# EAGLE design MaxOr (EAGLE 7.1.0)
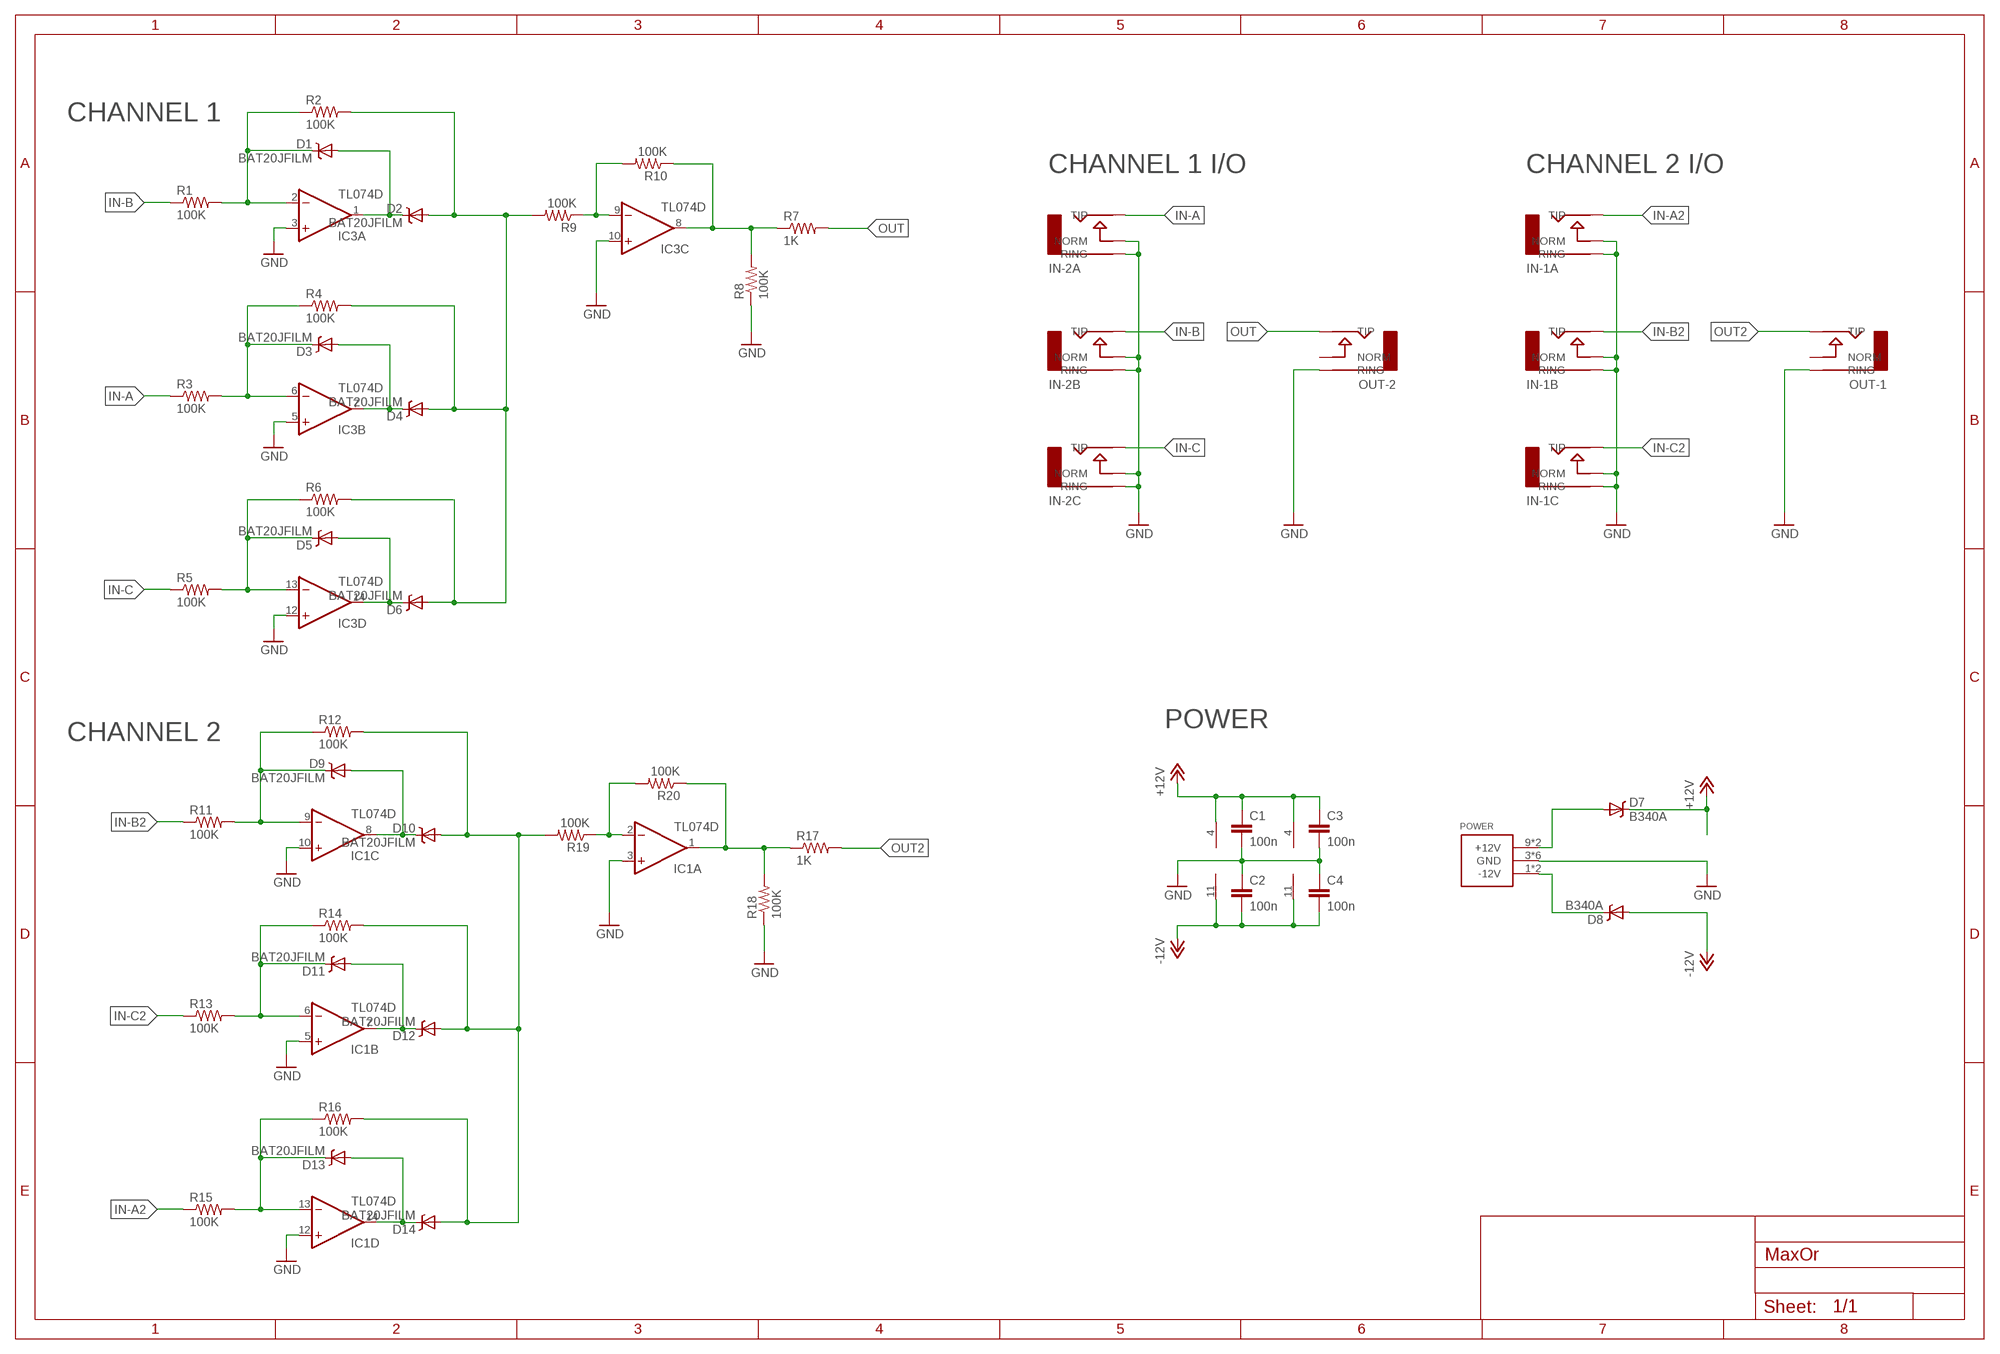
[diagram p0: schematic, sheet 1]

## Parts
C1  100n  CAP0805  [0805]
C2  100n  CAP0805  [0805]
C3  100n  CAP0805  [0805]
C4  100n  CAP0805  [0805]
D1  BAT20JFILM  [SOD-323]
D2  BAT20JFILM  [SOD-323]
D3  BAT20JFILM  [SOD-323]
D4  BAT20JFILM  [SOD-323]
D5  BAT20JFILM  [SOD-323]
D6  BAT20JFILM  [SOD-323]
D7  B340A  DIODE-SCHOTTKY-B340A  [SMA-DIODE]
D8  B340A  DIODE-SCHOTTKY-B340A  [SMA-DIODE]
D9  BAT20JFILM  [SOD-323]
D10  BAT20JFILM  [SOD-323]
D11  BAT20JFILM  [SOD-323]
D12  BAT20JFILM  [SOD-323]
D13  BAT20JFILM  [SOD-323]
D14  BAT20JFILM  [SOD-323]
IC1  TL074D  [SO14]
IC3  TL074D  [SO14]
IN-1A  AUDIO-JACK  [ERTHENVAR-JACK-HORIZONTAL]
IN-1B  AUDIO-JACK  [ERTHENVAR-JACK-HORIZONTAL]
IN-1C  AUDIO-JACK  [ERTHENVAR-JACK-HORIZONTAL]
IN-2A  AUDIO-JACK  [ERTHENVAR-JACK-HORIZONTAL]
IN-2B  AUDIO-JACK  [ERTHENVAR-JACK-HORIZONTAL]
IN-2C  AUDIO-JACK  [ERTHENVAR-JACK-HORIZONTAL]
OUT-1  AUDIO-JACK  [ERTHENVAR-JACK-HORIZONTAL]
OUT-2  AUDIO-JACK  [ERTHENVAR-JACK-HORIZONTAL]
POWER  POWER_SIMPLE10  [POWER_10]
R1  100K  RESISTOR0805-RES  [0805]
R2  100K  RESISTOR0805-RES  [0805]
R3  100K  RESISTOR0805-RES  [0805]
R4  100K  RESISTOR0805-RES  [0805]
R5  100K  RESISTOR0805-RES  [0805]
R6  100K  RESISTOR0805-RES  [0805]
R7  1K  RESISTOR0805-RES  [0805]
R8  100K  RESISTOR0805-RES  [0805]
R9  100K  RESISTOR0805-RES  [0805]
R10  100K  RESISTOR0805-RES  [0805]
R11  100K  RESISTOR0805-RES  [0805]
R12  100K  RESISTOR0805-RES  [0805]
R13  100K  RESISTOR0805-RES  [0805]
R14  100K  RESISTOR0805-RES  [0805]
R15  100K  RESISTOR0805-RES  [0805]
R16  100K  RESISTOR0805-RES  [0805]
R17  1K  RESISTOR0805-RES  [0805]
R18  100K  RESISTOR0805-RES  [0805]
R19  100K  RESISTOR0805-RES  [0805]
R20  100K  RESISTOR0805-RES  [0805]

## Nets
+12V: C1.1 C3.1 D7.C IC1.4(P:V+) IC3.4(P:V+)
-12V: C2.2 C4.2 D8.A IC1.11(P:V-) IC3.11(P:V-)
BUFFER: IC3.8(C:OUT) R7.1 R8.2 R10.1
BUFFER1: IC1.1(A:OUT) R17.1 R18.2 R20.1
GND: C1.2 C2.1 C3.2 C4.1 IC1.3(A:+IN) IC1.5(B:+IN) IC1.10(C:+IN) IC1.12(D:+IN) IC3.3(A:+IN) IC3.5(B:+IN) IC3.10(C:+IN) IC3.12(D:+IN) IN-1A.N(NORM) IN-1A.R@2(RING) IN-1B.N(NORM) IN-1B.R@2(RING) IN-1C.N(NORM) IN-1C.R@2(RING) IN-2A.N(NORM) IN-2A.R@2(RING) IN-2B.N(NORM) IN-2B.R@2(RING) IN-2C.N(NORM) IN-2C.R@2(RING) OUT-1.R@2(RING) OUT-2.R@2(RING) POWER.3(GND) POWER.4(GND) POWER.5(GND) POWER.6(GND) POWER.7(GND) POWER.8(GND) R8.1 R18.1
IN-A: IN-2A.T(TIP) R3.1
IN-A2: IN-1A.T(TIP) R15.1
IN-B: IN-2B.T(TIP) R1.1
IN-B2: IN-1B.T(TIP) R11.1
IN-C: IN-2C.T(TIP) R5.1
IN-C2: IN-1C.T(TIP) R13.1
N$1: D1.A D2.C IC3.1(A:OUT)
N$2: D3.A D4.C IC3.7(B:OUT)
N$3: D1.C IC3.2(A:-IN) R1.2 R2.1
N$4: D3.C IC3.6(B:-IN) R3.2 R4.1
N$5: D5.A D6.C IC3.14(D:OUT)
N$6: D5.C IC3.13(D:-IN) R5.2 R6.1
N$8: D7.A POWER.9(+12V) POWER.10(+12V)
N$9: D8.C POWER.1(-12V) POWER.2(-12V)
N$16: IC3.9(C:-IN) R9.1 R10.2
N$17: D9.A D10.C IC1.8(C:OUT)
N$18: D9.C IC1.9(C:-IN) R11.2 R12.1
N$19: D11.A D12.C IC1.7(B:OUT)
N$20: D11.C IC1.6(B:-IN) R13.2 R14.1
N$21: D13.A D14.C IC1.14(D:OUT)
N$22: D13.C IC1.13(D:-IN) R15.2 R16.1
N$23: IC1.2(A:-IN) R19.1 R20.2
OUT: OUT-2.T(TIP) R7.2
OUT2: OUT-1.T(TIP) R17.2
PREBUFFERED: D2.A D4.A D6.A R2.2 R4.2 R6.2 R9.2
PREBUFFERED1: D10.A D12.A D14.A R12.2 R14.2 R16.2 R19.2
Unconnected: OUT-1.N(NORM) OUT-2.N(NORM)

## Notes on the sheet
- CHANNEL 1
- CHANNEL 1 I/O | CHANNEL 2 I/O
- POWER
- CHANNEL 2

## Library data of the parts
C1-C4 = SparkFun-Capacitors:CAP: Capacitor Standard 0603 ceramic capacitor, and 0.1" leaded capacitor.
D1-D6 D9-D14 = SparkFun-DiscreteSemi:BAT20JFILM: 23V, 1A Schottky diode, SOD-323 package; PROD_ID: DIO-11623
D7 D8 = SparkFun-DiscreteSemi:DIODE-SCHOTTKY: Schottky diodes in SFE's production catalog BAT20J 1A 23V 0.62Vf RB751 120mA 40V 0.37Vf PMEG4005EJ 0.5A 40V 0.42Vf MBRA140 1A 40V 0.5Vf B340A 3A 40V SMA; PROD_ID: DIO-09886
IC1 IC3 = linear:TL074: OP AMP
IN-1A IN-1B IN-1C IN-2A IN-2B IN-2C OUT-1 OUT-2 = erthenvar:AUDIO-JACK: Switching Mono 3.5mm Audio Jack from Erthenvar. Horizontal package.
POWER = eurorack:POWER_SIMPLE
R1-R20 = SparkFun-Resistors:RESISTOR: Resistor Basic schematic elements and footprints for 0603, 1206, and PTH resistors.

## Board
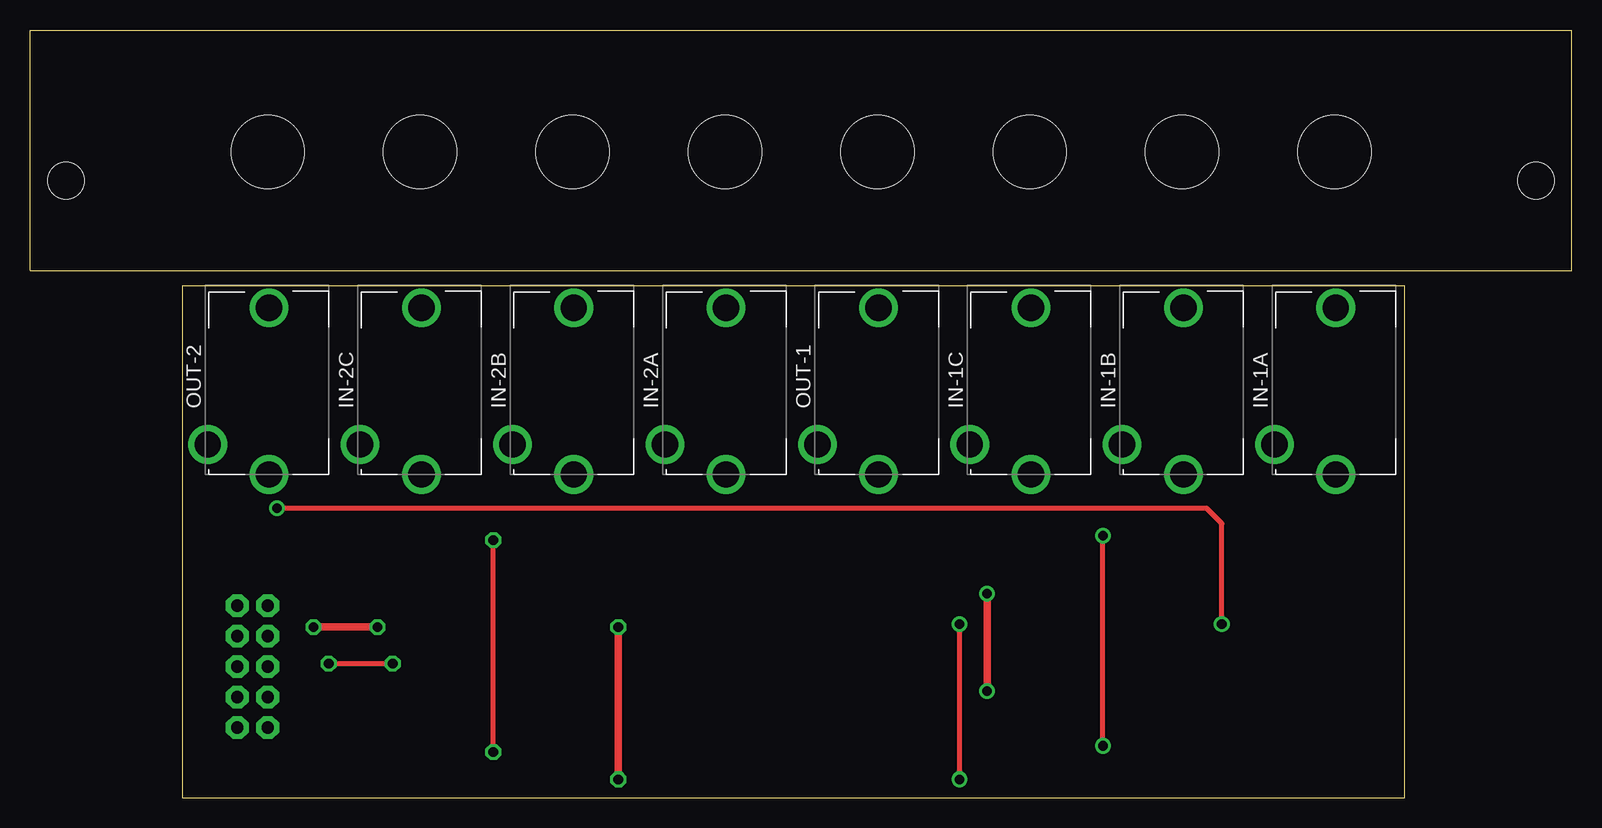
[diagram p1: board, top side]
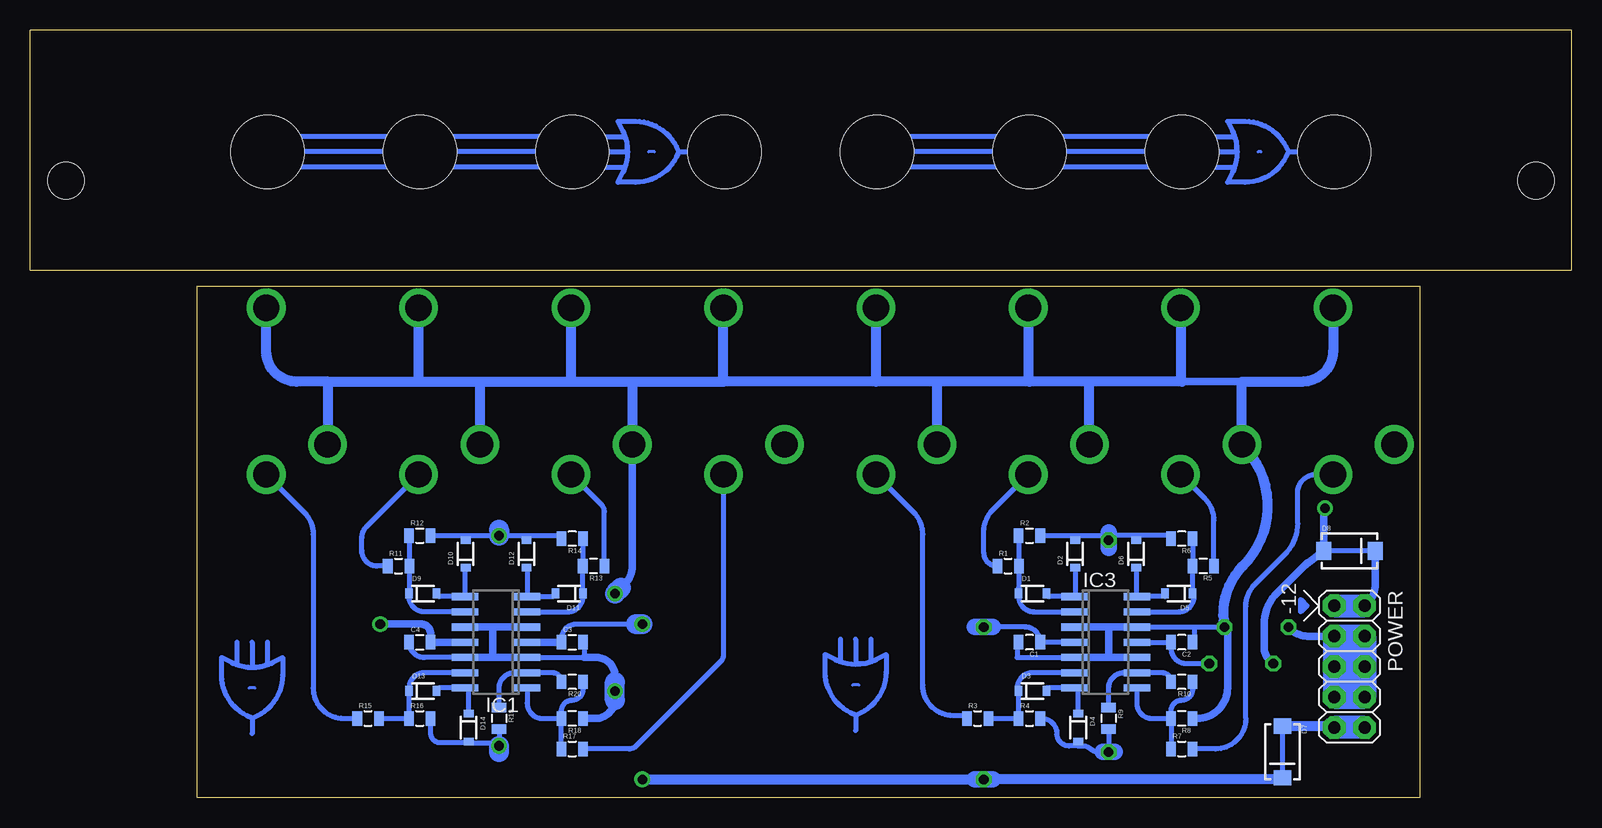
[diagram p2: board, bottom side, seen from below]

Size 128.5 x 64.01 mm. Coordinates in mm from the lower left corner, seen from the top.
Outline: 12.7,42.67 12.7,0 114.55,0 114.55,42.67 12.7,42.67
Outline: 0,43.94 128.5,43.94 128.5,64.01 0,64.01 0,43.94
Copper layers (1*16): Top 0.035mm / dielectric 1.5mm / Bottom 0.035mm
Design rules "Othermill-DRC-1-64": minimum track width 8mil, minimum drill 0.8mm, track to track 0.39878125mm, track to pad 0.39878125mm, pad to pad 0.39878125mm, via to via 0.39878125mm, smd to smd 0mil, copper to edge 0mil, drill to drill 1mil, minimum pad ring 10mil, minimum via ring 10mil, stop-mask expansion 1mil, vias tented up to drill 30mil, thermal gap 10mil
Holes 6.1 mm at 70.61,53.85 83.31,53.85 96.01,53.85 108.71,53.85 57.91,53.85 45.21,53.85 32.51,53.85 19.81,53.85

### Footprints (pad centres in the part's own frame; a part is rotated, then mirrored left to right if it is on the bottom)
0805 = smd 0.8 x 1.2: 1 -0.9,0; 2 0.9,0
SOD-323 = smd 0.63 x 0.83: A 1.15,0; C -1.15,0
SMA-DIODE = smd 1.27 x 1.47: A -2.15,0; C 2.15,0
SO14 = smd 0.6 x 2.2: 1 -3.81,-2.6; 2 -2.54,-2.6; 3 -1.27,-2.6; 4 0,-2.6; 5 1.27,-2.6; 6 2.54,-2.6; 7 3.81,-2.6; 8 3.81,2.6; 9 2.54,2.6; 10 1.27,2.6; 11 0,2.6; 12 -1.27,2.6; 13 -2.54,2.6; 14 -3.81,2.6
ERTHENVAR-JACK-HORIZONTAL = drill 2.2: N -5.1,5; R@2 6.3,-0.1; T -7.6,-0.1
POWER_10 = drill 1.016 pad 1.88 octagon: 1 -5.08,-1.27; 2 -5.08,1.27; 3 -2.54,-1.27; 4 -2.54,1.27; 5 0,-1.27; 6 0,1.27; 7 2.54,-1.27; 8 2.54,1.27; 9 5.08,-1.27; 10 5.08,1.27
MOUNTING-FIRST = hole 3.048: 3,7.5

### Placement (x,y rotation side)
C1  45.21,12.95 180 bottom
C2  32.51,12.95 180 bottom
C3  83.31,12.95 0 bottom
C4  96.01,12.95 0 bottom
D1  44.96,17.02 0 bottom
D2  41.4,20.32 90 bottom
D3  44.96,8.89 0 bottom
D4  41.15,5.84 270 bottom
D5  32.77,17.02 180 bottom
D6  36.32,20.32 90 bottom
D7  24.13,3.81 270 bottom
D8  18.54,20.57 0 bottom
D9  95.76,17.02 0 bottom
D10  92.2,20.32 90 bottom
D11  83.57,17.02 180 bottom
D12  87.12,20.32 90 bottom
D13  95.76,8.89 0 bottom
D14  91.95,5.84 270 bottom
IC1  89.66,12.95 90 bottom
IC3  38.86,12.95 270 bottom
IN-1A  108.71,34.54 90 top
IN-1B  96.01,34.54 90 top
IN-1C  83.31,34.54 90 top
IN-2A  57.91,34.54 90 top
IN-2B  45.21,34.54 90 top
IN-2C  32.51,34.54 90 top
OUT-1  70.61,34.54 90 top
OUT-2  19.81,34.54 90 top
POWER  18.54,10.92 270 bottom
R1  46.99,19.3 0 bottom
R2  45.21,21.84 0 bottom
R3  49.53,6.6 0 bottom
R4  45.21,6.6 0 bottom
R5  30.73,19.3 180 bottom
R6  32.51,21.59 180 bottom
R7  32.51,4.06 0 bottom
R8  32.51,6.6 180 bottom
R9  38.61,6.6 270 bottom
R10  32.51,9.65 180 bottom
R11  97.79,19.3 0 bottom
R12  96.01,21.84 0 bottom
R13  81.53,19.3 180 bottom
R14  83.31,21.59 180 bottom
R15  100.33,6.6 0 bottom
R16  96.01,6.6 0 bottom
R17  83.31,4.06 0 bottom
R18  83.31,6.6 180 bottom
R19  89.41,6.6 270 bottom
R20  83.31,9.65 180 bottom
U$1  MOUNT  [MOUNTING-FIRST]  0,43.94 0 top
U$3  MOUNT  [MOUNTING-FIRST]  128.5,43.94 0 bottom

### Tracks (layer width: path | path; a pad name or v marks a point on that pad's centre or on a via)
+12V  (via drill 0.8)
  Top 0.406: v77.47,1.52 v77.47,14.48
  Top 0.61: v49.02,1.52 v49.02,14.22
  Bottom 0.406: IC3.4 C1.1 arc-90 45.58,14.22 48.26,14.22 | C3.1 84.21,13.21 arc90 82.94,14.48 77.98,14.48
  Bottom 0.61: v49.02,1.52 47.75,1.52 | C3.1 IC1.4
  Bottom 0.813: D7.C arc90 24.27,1.52 v49.02,1.52 v77.47,1.52
  Bottom 1.372: 48.26,14.22 v49.02,14.22 49.78,14.22 | 48.26,1.52 v49.02,1.52 49.78,1.52
  Bottom 1.676: 77.98,14.48 v77.47,14.48
-12V  (via drill 0.8)
  Top 0.406: v24.89,11.18 v30.23,11.18 | v99.31,14.48 99.31,22.86 98.04,24.13 v20.57,24.13
  Bottom 0.406: 33.27,12.95 C2.2 | IC3.11 C2.2 | C2.2 33.41,12.45 arc-90 32.14,11.18 v30.23,11.18 | 95,12.95 95,13.21 | v20.57,24.13 arc-90 20.69,24.01
  Bottom 0.61: D8.A 20.77,20.57 | 22.33,19.32 24.54,17.12 arc-45 25.65,14.42 25.65,12.46 arc-45 25.28,11.57 v24.89,11.18 | 22.33,19.32 arc8 22.05,19.57 | IC1.11 95,12.95 C4.2 95.11,13.66 arc-90 95.92,14.48 v99.31,14.48 | 20.69,24.01 D8.A | D8.A 22.33,19.32
BUFFER
  Bottom 0.406: IC3.8 36.26,7.87 arc-90 34.99,6.6 R8.2 | R8.2 R7.1 | R8.2 33.41,7.23 arc90 32.51,8.13 arc-90 31.61,9.03 R10.1
BUFFER1
  Bottom 0.406: R17.1 R18.2 | R18.2 84.21,7.23 arc90 83.31,8.13 arc-90 82.41,9.03 R20.1 | IC1.1 87.06,7.87 arc-90 85.79,6.6 R18.2
GND  (via drill 0.8)
  Top 0.61: v23.62,14.22 v28.96,14.22 | v79.76,8.89 v79.76,17.02
  Bottom 0.406: C1.2 46.23,12.95 46.23,11.68 IC3.5 | 31.5,14.22 31.5,12.95 C2.1 | 31.5,14.22 v28.96,14.22 | IC3.12 31.5,14.22 | IC1.12 95.64,11.68 arc90 C4.1 | IC1.3 82.3,11.68 82.3,12.84 arc-90 C3.2 | R18.1 82.3,6.6
  Bottom 0.61: POWER.3 22.04,13.46 arc45 23.47,14.07 v23.62,14.22 | 38.61,14.22 38.61,11.68 | R8.1 31.24,6.6 arc-90 28.7,9.14 28.7,13.68 arc-45 28.94,14.21 v28.96,14.22 | 27.43,29.25 arc-45 IN-2C.N | 27.51,34.69 32.51,34.69 arc90 32.61,34.79 | 40.21,34.61 arc90 40.13,34.69 | 45.31,34.79 arc-90 45.21,34.69 | IC3.3 38.61,14.22 | IC3.5 38.61,11.68 | 89.92,11.68 IC1.12 | IC1.10 89.92,14.22 | 89.92,14.22 89.92,11.68 | IC1.5 89.92,14.22 | 89.92,11.68 IC1.3 | 82.3,11.68 81.28,11.68 arc90 79.76,10.16 79.76,9.65 v79.76,8.89 | 79.27,17.51 arc-45 78.31,19.09 IN-1C.N | 82.3,6.6 81.53,6.6 arc-90 79.76,8.13 | 38.61,14.22 IC3.12 | 38.61,11.68 IC3.10
  Bottom 0.813: IN-2A.N 52.91,34.69 | 32.51,34.69 40.13,34.69 45.21,34.69 52.91,34.69 | OUT-2.R@2 19.91,37.23 arc90 22.45,34.69 27.51,34.69 IN-2C.N arc91 27.43,19.3 arc-57 v28.96,14.22 | IN-2C.R@2 32.61,34.79 | IN-2B.N 40.21,34.61 | IN-2B.R@2 45.31,34.79 | IN-2A.R@2 58.01,34.69 | 58.01,34.69 70.71,34.69 | 103.63,34.69 106.27,34.69 arc90 108.81,37.23 IN-1A.R@2 | IN-1A.N arc-90 103.63,29.52 103.63,34.69 | 103.63,34.69 96.11,34.69 | 96.11,34.69 IN-1B.R@2 | 96.11,34.69 91.01,34.69 | 91.01,34.69 IN-1B.N | 91.01,34.69 83.41,34.69 | 83.41,34.69 IN-1C.R@2 | 83.41,34.69 78.31,34.69 | 78.31,34.69 IN-1C.N | 78.31,34.69 70.71,34.69 | 70.71,34.69 OUT-1.R@2 | 52.91,34.69 58.01,34.69
  Bottom 1.676: 79.76,8.13 79.76,9.65 | 79.27,17.51 v79.76,17.02
  Bottom 1.93: POWER.4 POWER.6 | POWER.6 POWER.8 | POWER.8 18.54,9.65 18.54,12.19 POWER.4 | POWER.4 POWER.3 POWER.5 | POWER.8 POWER.7 POWER.5 | POWER.6 POWER.5
IN-A
  Bottom 0.406: R3.1 arc-45 50.53,6.84 51.56,6.84 arc90 54.1,9.38 54.1,21.98 arc-45 54.85,23.78 IN-2A.T
IN-A2
  Bottom 0.406: IN-1A.T 105.65,23.78 arc45 104.9,21.98 104.9,9.14 arc-90 102.36,6.6 R15.1
IN-B
  Bottom 0.406: R1.1 arc90 49.02,20.44 49.02,22.18 arc45 48.28,23.98 IN-2B.T
IN-B2
  Bottom 0.406: R11.1 99.57,19.3 arc90 100.84,20.57 100.84,21.69 arc45 100.47,22.59 IN-1B.T
IN-C
  Bottom 0.406: 29.72,19.3 R5.1 29.83,23.11 arc-45 30.58,24.91 IN-2C.T
IN-C2
  Bottom 0.406: R13.1 80.63,23.83 arc-45 80.87,24.4 IN-1C.T
LABEL
  Bottom 0.406: 109.98,6.6 109.55,6.82 arc-63 107.44,10.23 107.44,11.68 108.28,11.27 | 109.98,6.6 110.42,6.82 arc63 112.52,10.23 112.52,11.68 111.69,11.27 | 111.69,11.27 arc-53 108.28,11.27 | 108.71,12.95 108.71,11.18 | 111.25,12.95 111.25,11.18 111.47,11.18 arc45 111.69,11.27 | 108.71,11.18 108.5,11.18 arc-45 108.28,11.27 | 109.98,12.95 109.98,10.92 109.33,10.92 arc-45 108.71,11.18 | 109.98,6.6 109.98,5.33
LABEL1
  Bottom 0.406: 59.69,6.86 59.26,7.08 arc-63 57.15,10.48 57.15,11.94 57.99,11.52 | 59.69,6.86 60.12,7.08 arc63 62.23,10.48 62.23,11.94 61.39,11.52 | 61.39,11.52 arc-53 57.99,11.52 | 58.42,13.21 58.42,11.43 | 60.96,13.21 60.96,11.43 61.18,11.43 arc45 61.39,11.52 | 58.42,11.43 58.2,11.43 arc-45 57.99,11.52 | 59.69,13.21 59.69,11.18 59.03,11.18 arc-45 58.42,11.43 | 59.69,6.86 59.69,5.59
LABEL2
  Bottom 0.406: 74.42,53.85 74.64,54.28 arc-63 78.05,56.39 79.5,56.39 79.08,55.55 | 74.42,53.85 74.64,53.41 arc63 78.05,51.31 79.5,51.31 79.08,52.14 | 79.08,52.14 arc-53 79.08,55.55 | 80.77,55.12 78.99,55.12 | 80.77,52.58 78.99,52.58 78.99,52.36 arc45 79.08,52.14 | 78.99,55.12 78.99,55.34 arc-45 79.08,55.55 | 80.77,53.85 78.74,53.85 78.74,54.5 arc-45 78.99,55.12 | 74.42,53.85 73.15,53.85
LABEL3
  Bottom 0.406: 23.62,53.85 23.84,54.28 arc-63 27.25,56.39 28.7,56.39 28.28,55.55 | 23.62,53.85 23.84,53.41 arc63 27.25,51.31 28.7,51.31 28.28,52.14 | 28.28,52.14 arc-53 28.28,55.55 | 29.97,55.12 28.19,55.12 | 29.97,52.58 28.19,52.58 28.19,52.36 arc45 28.28,52.14 | 28.19,55.12 28.19,55.34 arc-45 28.28,55.55 | 29.97,53.85 27.94,53.85 27.94,54.5 arc-45 28.19,55.12 | 23.62,53.85 22.35,53.85
N$1
  Bottom 0.406: 41.4,16.76 IC3.1 | IC3.1 43.55,16.76 arc90 D1.A | D2.C 41.4,16.82 arc90 IC3.1
N$2
  Bottom 0.406: 41.4,9.14 IC3.7 | IC3.7 43.81,9.14 D3.A | D4.C 41.15,9.14 IC3.7
N$3
  Bottom 0.406: IC3.2 44.84,15.49 arc90 46.09,16.75 46.09,17.04 | R2.1 46.11,17.53 arc90 46.11,17.52 D1.C arc-90 46.09,17.04 | 46.11,19.3 R1.2 46.09,17.04
N$4
  Bottom 0.406: IC3.6 44.96,10.41 arc-90 46.23,9.14 46.23,8.89 D3.C R4.1 | R4.1 | R3.2 R4.1
N$5
  Bottom 0.406: D6.C 36.32,16.76 IC3.14 33.92,16.76 D5.A
N$6
  Bottom 0.406: IC3.13 32.77,15.49 arc-90 31.5,16.76 31.61,16.76 | R6.1 31.61,19.3 | 31.61,16.76 31.61,19.3 | 31.61,19.3 R5.2 | D5.C 31.62,16.76 31.61,16.76
N$8
  Bottom 0.61: D7.A arc-90 24.01,5.84
  Bottom 0.813: POWER.9 arc-90 19.93,5.96 D7.A
  Bottom 1.93: POWER.10 POWER.9
N$9
  Bottom 0.61: D8.C 16.39,17.62 arc45 POWER.2
  Bottom 1.93: POWER.1 POWER.2
N$12
  Bottom 0.406: 16,20.57 21.08,20.57
N$13
  Bottom 0.406: 22.61,16.51 22.1,16 22.61,15.49 22.61,16.51
N$14
  Bottom 0.406: 24.13,5.84 24.13,1.52
N$15
  Bottom 0.406: 35.05,53.85 57.91,53.85
N$16
  Bottom 0.406: R9.1 38.61,9.14 arc90 37.34,10.41 IC3.9 34.17,10.41 arc90 R10.2
N$17
  Bottom 0.406: D10.C arc-90 92.26,19.11 IC1.8 94.35,16.76 arc90 D9.A
N$18
  Bottom 0.406: R12.1 96.91,19.36 arc-45 R11.2 96.89,17.06 arc45 D9.C 96.91,16.76 arc-90 95.64,15.49 IC1.9
N$19
  Bottom 0.406: D12.C arc90 87.06,19.11 IC1.7 84.97,16.76 arc-90 D11.A
N$20
  Bottom 0.406: IC1.6 83.69,15.49 arc-90 82.42,16.76 D11.C arc90 82.43,17.04 R13.2 arc-90 82.41,19.33 R14.1
N$21
  Bottom 0.406: D14.C 91.95,8.83 arc-90 IC1.14 94.35,9.14 arc-90 D13.A
N$22
  Bottom 0.406: R15.2 R16.1 arc-90 R16.1 D13.C 96.91,9.14 arc90 95.64,10.41 IC1.13
N$23
  Bottom 0.406: R19.1 89.41,9.14 arc90 88.14,10.41 IC1.2 84.97,10.41 arc90 R20.2
N$24
  Bottom 0.406: 83.31,53.85 108.71,53.85
N$25
  Bottom 0.406: 35.05,55.12 57.66,55.12 | 85.85,55.12 108.46,55.12
N$26
  Bottom 0.406: 34.8,52.58 57.66,52.58 | 85.6,52.58 108.46,52.58
N$27
  Bottom 0.254: 59.44,9.4 59.94,9.4 | 109.73,9.14 110.24,9.14
N$28
  Bottom 0.254: 25.91,53.85 26.16,53.85
N$29
  Bottom 0.254: 76.45,53.85 76.96,53.85
OUT
  Bottom 0.406: R7.2 29.72,4.06 arc-90 27.18,6.6 27.18,15.97 arc45 26.43,17.76 23.98,20.22 arc-45 22.86,22.91 22.86,25.42 arc90 21.34,26.94 OUT-2.T
OUT2
  Bottom 0.406: OUT-1.T 70.71,11.92 arc45 70.95,11.35 77.99,4.3 arc45 78.57,4.06 R17.2
PREBUFFERED  (via drill 0.8)
  Top 0.406: v38.61,3.81 v38.61,21.47
  Bottom 0.406: R4.2 44.2,6.6 arc90 42.93,5.33 arc-90 41.91,4.32 41.15,4.32 | R2.2 41.4,21.84 | 41.4,21.84 38.61,21.84 | 33.41,21.47 R6.2 33.41,21.84 36.32,21.84 | 41.15,4.32 D4.A | 36.32,21.59 D6.A 36.32,21.84 | 38.61,21.59 38.61,21.84 | 36.32,21.84 38.61,21.84 | D2.A 41.4,21.84 | R9.2 v38.61,3.81 | 41.15,4.32 40.74,4.32 arc45 40.13,4.06 arc-45 39.52,3.81 39.12,3.81
  Bottom 1.372: 38.61,22.1 38.61,21.59 v38.61,21.47 38.61,20.83 | 39.12,3.81 v38.61,3.81 38.1,3.81
PREBUFFERED1  (via drill 0.8)
  Top 0.406: v89.41,4.32 v89.41,21.84
  Top 0.813: v89.41,21.84 arc90 89.41,21.59
  Bottom 0.406: R12.2 92.2,21.84 | 87.38,21.84 v89.41,21.84 92.2,21.84 | 87.38,21.84 84.47,21.84 arc90 R14.2 | D12.A arc90 87.38,21.72 87.38,21.84 | R19.2 89.41,4.57 | 89.41,4.57 89.41,3.81 | D14.A 91.97,4.67 arc45 92.2,4.57 | 95,6.49 arc-90 R16.2 95.11,5.38 arc-90 94.3,4.57 92.2,4.57 | D10.A 92.2,21.84 | 92.2,4.57 89.41,4.57
  Bottom 1.676: 89.41,22.35 v89.41,21.84 | 89.41,3.81 v89.41,4.32